# Altium schematic sheet 02_MCU_PERIPHERAL.SchDoc
size A4
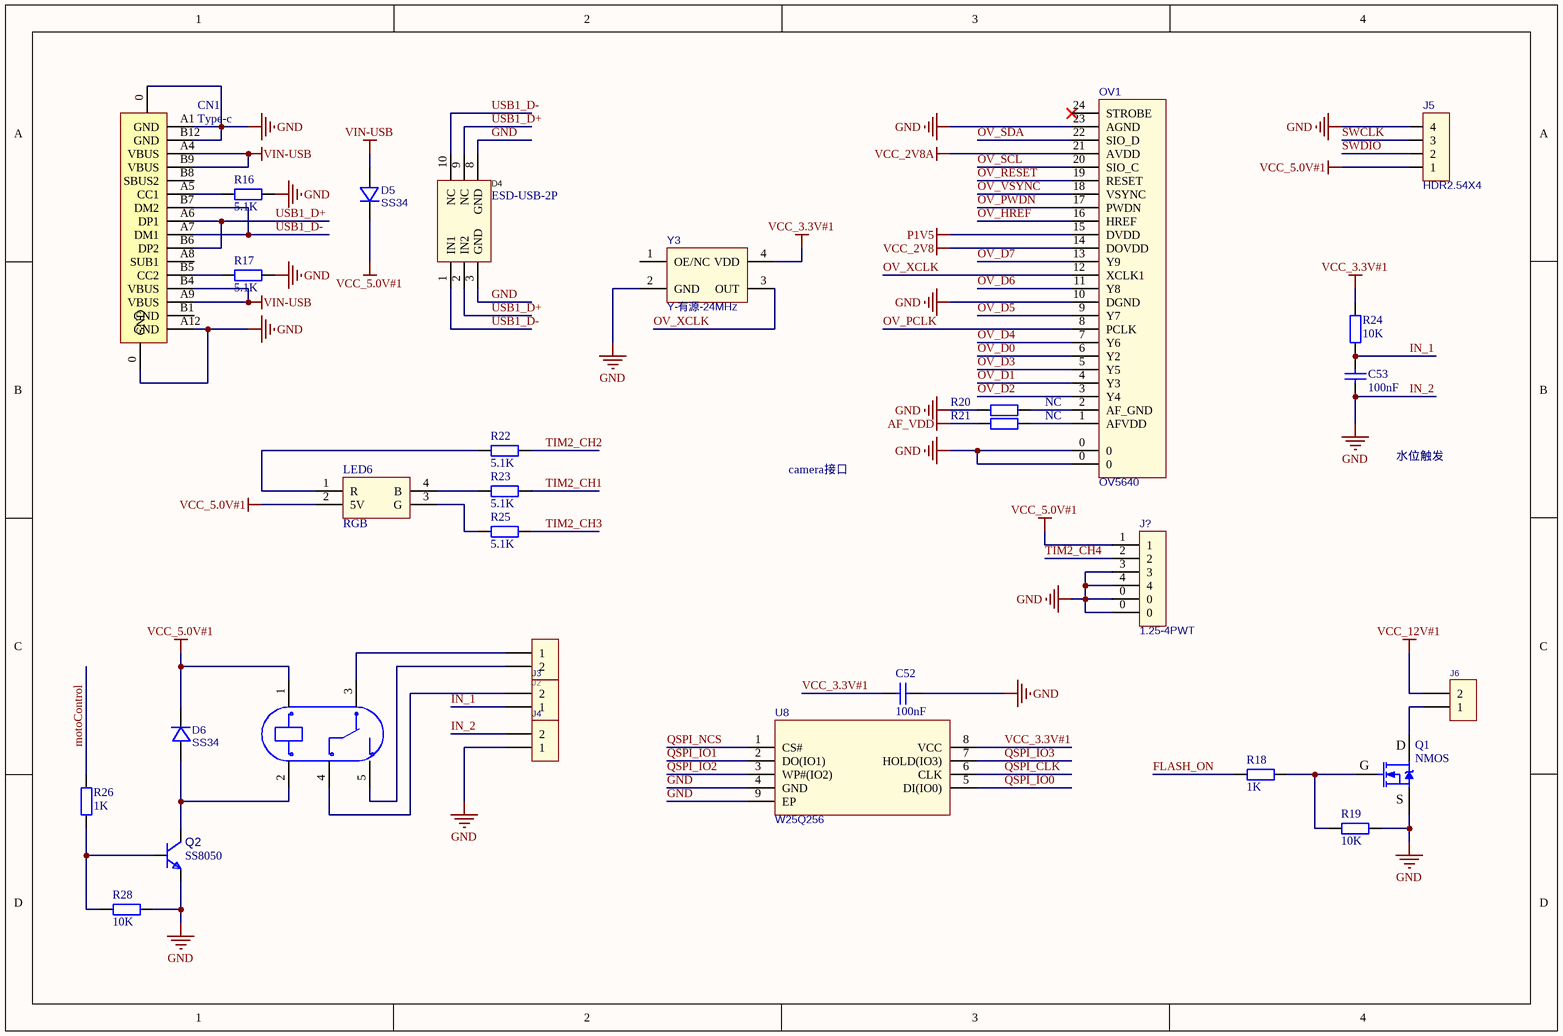
[diagram p0: 02_MCU_PERIPHERAL.SchDoc]

## Parts
C52  100nF  [0603-C]
C53  100nF  [0603-C]
CN1  Type-c  [Type-c 16pin]
D4  ESD-USB-2P  [SLP2510P8-2P]
D5  SS34  [SS34-SMA]
D6  SS34  [SS34-SMA]
J2  KF128-5.0-2P  [KF128-5.0-2P]  (value not drawn)
J3  KF128-5.0-2P  [KF128-5.0-2P]  (value not drawn)
J4  KF128-5.0-2P  [KF128-5.0-2P]  (value not drawn)
J5  HDR2.54X4  [HDR2.54-LI-4P]
J6  KF128-5.0-2P  [KF128-5.0-2P]  (value not drawn)
J?  1.25-4PWT  [H1.25-4P]
K1  JQC-3FF/005-1ZS(551)  [RELAY-TH_HF3FF-XX-1ZXX-XXX]  (value not drawn)
LED6  RGB  [RGB-LED]
OV1  OV5640  [FPC-SMD_P0.50-24P_XJ-FGS]
Q1  NMOS  [AO3400]
Q2  SS8050  [SOT23-3M]
R16  5.1K  [0603-R]
R17  5.1K  [0603-R]
R18  1K  [0603-R]
R19  10K  [0603-R]
R20  NC  [0603-R]
R21  NC  [0603-R]
R22  5.1K  [0603-R]
R23  5.1K  [0603-R]
R24  10K  [0603-R]
R25  5.1K  [0603-R]
R26  1K  [0603-R]
R28  10K  [0603-R]
U8  W25Q256  [W25Q256]
Y3  Y-有源-24MHz  [3225]

## Nets
AF_VDD: R21.2
GND: C52.1 C53.1 CN1.0(GND) CN1.A1(GND) CN1.A12(GND) CN1.B12(GND) D4.3(GND) D4.8(GND) J4.1 J4.2 J5.4 J?.0 J?.3 J?.4 OV1.0 OV1.10(DGND) OV1.23(AGND) Q1.2(S) Q2.2(E) R16.2 R17.2 R19.1 R20.2 R28.1 U8.4(GND) U8.9(EP) Y3.2(GND)  [also labelled IN_2]
P1V5: OV1.15(DVDD)
VCC_2V8: OV1.14(DOVDD)
VCC_2V8A: OV1.21(AVDD)
VCC_3.3V#1: C52.2 R24.2 U8.8(VCC) Y3.4(VDD)
VCC_5.0V#1: D5.2(-) D6.2(-) J5.1 J?.1 K1.1 LED6.2(5V)
VCC_12V#1: J6.2
VIN-USB: CN1.A4(VBUS) CN1.A9(VBUS) CN1.B4(VBUS) CN1.B9(VBUS) D5.1(+)
FLASH_ON: R18.2
IN_1: C53.2 J3.1 R24.1
motoControl: R26.2
OV_D0: OV1.6(Y2)
OV_D1: OV1.4(Y3)
OV_D2: OV1.3(Y4)
OV_D3: OV1.5(Y5)
OV_D4: OV1.7(Y6)
OV_D5: OV1.9(Y7)
OV_D6: OV1.11(Y8)
OV_D7: OV1.13(Y9)
OV_HREF: OV1.16(HREF)
OV_PCLK: OV1.8(PCLK)
OV_PWDN: OV1.17(PWDN)
OV_RESET: OV1.19(RESET)
OV_SCL: OV1.20(SIO_C)
OV_SDA: OV1.22(SIO_D)
OV_VSYNC: OV1.18(VSYNC)
OV_XCLK: OV1.12(XCLK1) Y3.3(OUT)
QSPI_CLK: U8.6(CLK)
QSPI_IO0: U8.5(DI(IO0))
QSPI_IO1: U8.2(DO(IO1))
QSPI_IO2: U8.3(WP#(IO2))
QSPI_IO3: U8.7(HOLD(IO3))
QSPI_NCS: U8.1(CS#)
SWCLK: J5.3
SWDIO: J5.2
TIM2_CH1: R23.2
TIM2_CH2: R22.2
TIM2_CH3: R25.2
TIM2_CH4: J?.2
USB1_D+: CN1.A6(DP1) CN1.B6(DP2) D4.2(IN2) D4.9(NC)
USB1_D-: CN1.A7(DM1) CN1.B7(DM2) D4.1(IN1) D4.10(NC)
NetCN1_A5: CN1.A5(CC1) R16.1
NetCN1_B5: CN1.B5(CC2) R17.1
NetD6_1: D6.1(+) K1.2 Q2.3(C)
NetJ2_1: J2.1 K1.3
NetJ2_2: J2.2 K1.5
NetJ3_2: J3.2 K1.4
NetJ6_1: J6.1 Q1.3(D)
NetLED6_1: LED6.1(R) R22.1
NetLED6_3: LED6.3(G) R25.1
NetLED6_4: LED6.4(B) R23.1
NetOV1_1: OV1.1(AFVDD) R21.1
NetOV1_2: OV1.2(AF_GND) R20.1
NetQ1_1: Q1.1(G) R18.1 R19.2
NetQ2_1: Q2.1(B) R26.1 R28.2

Not connected (* = marked no-connect by the designer): CN1 A8(SUB1) B1(GND) B8(SBUS2); OV1 24(STROBE)*; Y3 1(OE/NC)

## Notes on the sheet
- camera接口
- 水位触发

## Library data of the parts
C52 C53 = C: 贴片电容; BOM名称: 无极性贴片电容; 联系卖家，免费查找封装: 唯一出售店铺网址https://shop463601444.taobao.com
CN1 = Type-c: U262-161N-4BVC11
D4 = ESD-USB-2P: RClamp0522PATCT; Manufacturer: SEMTECH; Name: RClamp0524PATCT; Device: RClamp0524PATCT_C40960; Add into BOM: yes; Reverse Stand-Off Voltage (Vrwm): 5V; Breakdown Voltage (VBR): 6V; Clamping Voltage@Ipp: 15V; Peak Pulse Power(Ppp)@8/20us: 150W; Junction Capacitance(Cj)@1MHz: 0.8pF@1MHz; Symbol: RClamp0524PATCT; LCSC Part Name: RClamp0524PATCT; Supplier Part: C40960; Manufacturer Part: RClamp0524PATCT; Supplier Footprint: SLP2510P8; JLCPCB Part Class: Extended Part; Datasheet: https://atta.szlcsc.com/upload/public/pdf/source/20150124/1457707260739.pdf; Supplier: LCSC; Convert to PCB: yes; Operating Temperature: -55℃~+125℃@(Tj)
D5 D6 = SS34: BOM_Manufacturer: Wuxi ARK Tech Elec; BOM_Manufacturer Part: D-G060306G1-KS2; Contributor: LCSC; BOM_Supplier: LCSC; BOM_Supplier Part: C118334; BOM_JLCPCB Part Class: Extended Part; spicePre: L; spiceSymbolName: D-G060306G1-KS2
J2-J4 J6 = KF128-5.0-2P: Manufacturer: KEFA(科发); Add into BOM: yes; Pitch: 5mm; Structure: 1x2P; Number of PINs Per Row: 2; Current Rating (Max): 24A; Voltage Rating (Max): 250V; Wire Gauge - AWG: 12~22; Wire Gauge - mm2: 2.5; Name: KF128-5.0-2P; Symbol: KF128-5.0-2P; Device: KF128-5.0-2P; LCSC Part Name: 5mm 1x2P 排数:1 每排P数:2 直插 可拼接 铜 环保; Supplier Part: C474950; Manufacturer Part: KF128-5.0-2P; Supplier Footprint: 插件,P=5mm; JLCPCB Part Class: Extended Part; Datasheet: https://atta.szlcsc.com/upload/public/pdf/source/20230317/B8CD42C0E3A38C01CD877E6842427715.pdf; Supplier: LCSC; Convert to PCB: yes; Number of Rows: 1; Mounting Style: 直插; Operating Temperature Range: -40℃~+105℃; Color: 绿色; Number of Pins: 2P
J5 = HDR2.54X4: BOM_Manufacturer: BOOMELE; BOM_Manufacturer Part: 1.27mm/1*3p; BOM_Supplier: LCSC; BOM_Supplier Part: C24980; BOM_JLCPCB Part Class: Extended Part; spicePre: P; spiceSymbolName: 1.27mm/1*3p
J? = H1.25-4P: BOM_Manufacturer: FG(富港); Contributor: LCSC; BOM_Supplier: LCSC; BOM_Supplier Part: C2763632; BOM_Manufacturer Part: 1.25-4PWT; JLCPCB Part Class: Extended Part; spicePre: C; spiceSymbolName: 1.25-4PWT
K1 = JQC-3FF/005-1ZS(551): Manufacturer: HF(宏发); Symbol: JQC-3FF/05-1ZS(551); Add into BOM: yes; Coil Voltage: 5V; Coil Type: 非极化-单线圈; Pin Number: 5; Contact Form: 一组转换:1C(单刀双掷-转换); Maximum Switching Current: 10A; Maximum Switching Voltage: 277V@AC；30V@DC; Coil Rated Power: 360mW; Contact Rating: 10A@28VDC；10A@277VAC; Coil Resistance: 70Ω; Operate Time: 10ms; Release Time: 5ms; Contact Resistance: 100mΩ; Name: JQC-3FF/005-1ZS(551); Device: JQC-3FF/005-1ZS(551); LCSC Part Name: 超小型大功率5V继电器 单刀双掷; Supplier Part: C9221; Manufacturer Part: JQC-3FF/005-1ZS(551); Supplier Footprint: 插件,15.5x19mm; JLCPCB Part Class: Extended Part; Datasheet: https://atta.szlcsc.com/upload/public/pdf/source/20210906/31FD0911648F640D4227475E890A46EB.pdf; Supplier: LCSC; Convert to PCB: yes; Contact Material: AgCdO; Operating Temperature: -40℃~+85℃
LED6 = RGB-LED
OV1 = OV5640_BACK: BOM_Manufacturer: Shenzhen Cankemeng; Contributor: LCSC; BOM_Supplier: LCSC; BOM_Supplier Part: C132514; BOM_Manufacturer Part: -; BOM_JLCPCB Part Class: Extended Part; spicePre: F; spiceSymbolName: FPC0.5-24P
Q1 = AO3400: N沟道 30V/4.2A; BOM名称: 场效应管; 联系卖家，免费查找封装: 唯一出售店铺网址https://shop463601444.taobao.com; 参数: N沟道 30V/4.2A
R16-R26 R28 = R: 贴片电阻; 联系卖家，免费查找封装: 唯一出售店铺网址https://shop463601444.taobao.com; BOM名称: 贴片电阻
U8 = W25Q256: BOM_Manufacturer: WINBOND(华邦); BOM_Manufacturer Part: W25Q256JVEIQ; Contributor: LCSC; BOM_Supplier: LCSC; BOM_Supplier Part: C2682312; BOM_JLCPCB Part Class: Extended Part; spicePre: U; spiceSymbolName: W25Q256JVEIQ
Y3 = Y-有源: 有源晶振; BOM_Manufacturer: YXC扬兴科技; BOM_Manufacturer Part: OT322540MJBA4SL; nameAlias: Frequency; Contributor: LCSC; BOM_Supplier: LCSC; BOM_Supplier Part: C2831396; BOM_JLCPCB Part Class: Extended Part; spicePre: X; spiceSymbolName: OT322540MJBA4SL